# Altium schematic sheet Sheet1.SchDoc
size A4; SheetNumber: 1; SheetTotal: 1
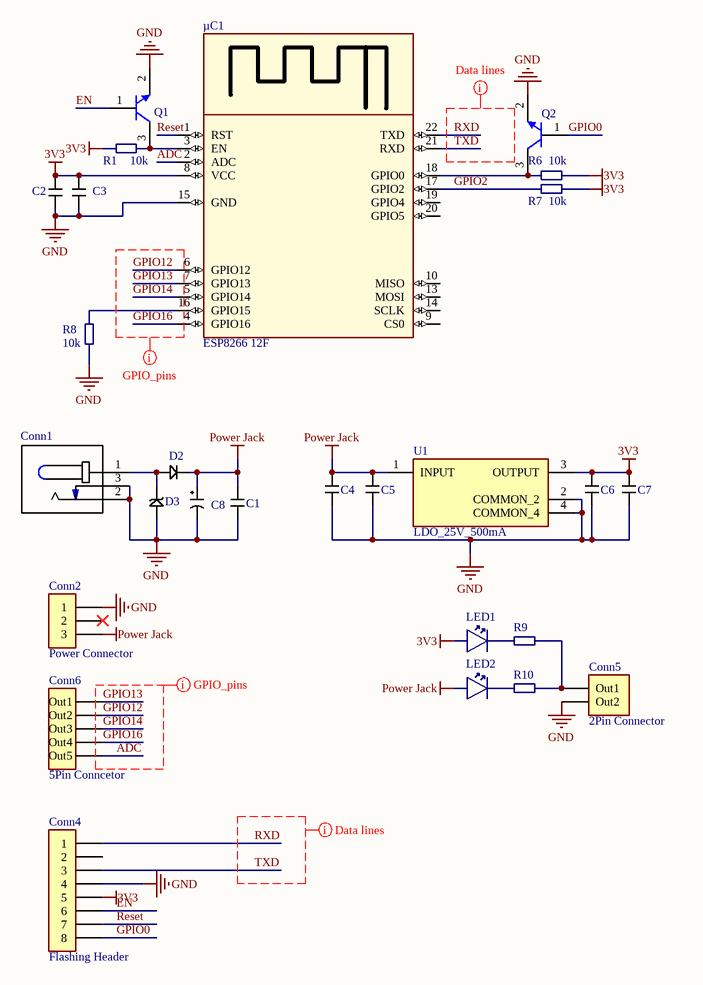
[diagram p0: Sheet1.SchDoc]

## Parts
C1  Cap 0603  [CAP 0603]  (value not drawn)
C2  Cap 0603  [CAP 0603]  (value not drawn)
C3  Cap 0603  [CAP 0603]  (value not drawn)
C4  Cap 0603  [CAP 0603]  (value not drawn)
C5  Cap 0603  [CAP 0603]  (value not drawn)
C6  Cap 0603  [CAP 0603]  (value not drawn)
C7  Cap 0603  [CAP 0603]  (value not drawn)
C8  ElcoCap  [SMD Elco]  (value not drawn)
Conn1  Power Jack SMD rechtwinklig  [Power Jack]  (value not drawn)
Conn2  Power Connector  [3Pin CONNECTOR]
Conn4  Flashing Header  [Flashing header 2*5]
Conn5  2Pin Connector  [2PIN Connector]
Conn6  5Pin Conncetor  [5PIN CONNECTOR]
D2  Schottky Diode  [SS34-HF]  (value not drawn)
D3  TVS Diode  [SMAJ24A]  (value not drawn)
LED1  LED SMD  [LED 0603]  (value not drawn)
LED2  LED SMD  [LED 0603]  (value not drawn)
Q1  BC818-40LT1G  [ONSC-SOT-23-3-318-08_V]  (value not drawn)
Q2  BC818-40LT1G  [ONSC-SOT-23-3-318-08_V]  (value not drawn)
R1  10k  [RES 0603]
R6  10k  [RES 0603]
R7  10k  [RES 0603]
R8  10k  [RES 0603]
R9  Res 0603  [RES 0603]  (value not drawn)
R10  Res 0603  [RES 0603]  (value not drawn)
U1  LDO_25V_500mA  [UA78M33CDCYRG3]
µC1  ESP8266 12F  [ESP8266 12F]

## Nets
3V3: C2.2 C3.2 C6.2 C7.2 Conn4.5 LED1.1 R1.2 R6.2 R7.2 U1.3(OUTPUT) µC1.8(VCC)
GND: C1.1 C2.1 C3.1 C4.1 C5.1 C6.1 C7.1 C8.2(N) Conn1.2 Conn1.3 Conn2.3(1) Conn4.4 Conn5.2(Out2) D3.1 Q1.2(E) Q2.2(E) R8.1 U1.2(COMMON_2) U1.4(COMMON_4) µC1.15(GND)
Power Jack: C1.2 C4.2 C5.2 C8.1(P) Conn2.1(3) D2.2 LED2.1 U1.1(INPUT)
ADC: Conn6.5(Out5) µC1.2(ADC)
EN: Conn4.6 Q1.1(B)
GPIO0: Conn4.8 Q2.1(B)
GPIO2: R7.1 µC1.17(GPIO2)
GPIO12: Conn6.2(Out2) µC1.6(GPIO12)
GPIO13: Conn6.1(Out1) µC1.7(GPIO13)
GPIO14: Conn6.3(Out3) µC1.5(GPIO14)
GPIO16: Conn6.4(Out4) µC1.4(GPIO16)
Reset: Conn4.7 µC1.1(RST)
RXD: Conn4.1 µC1.22(TXD)
TXD: Conn4.3 µC1.21(RXD)
NetConn1_1: Conn1.1 D2.1 D3.2
NetConn5_1: Conn5.1(Out1) R9.2 R10.2
NetLED1_2: LED1.2 R9.1
NetLED2_2: LED2.2 R10.1
NetQ1_3: Q1.3(C) R1.1 µC1.3(EN)
NetQ2_3: Q2.3(C) R6.1 µC1.18(GPIO0)
NetR8_2: R8.2 µC1.16(GPIO15)

Not connected (* = marked no-connect by the designer): Conn2 2*; Conn4 2; µC1 9(CS0) 10(MISO) 13(MOSI) 14(SCLK) 19(GPIO4) 20(GPIO5)

## Layout directives
mark named GPIO_pins: ADC, GPIO12, GPIO13, GPIO14, GPIO16
mark named Data lines: RXD, TXD
net class data: RXD, TXD

## Library data of the parts
Conn2 = 3Pin Connector
Q1 Q2 = CMP-1048-00772-1: General Purpose Transistor, NPN Silicon, 3-Pin SOT-23, Pb-Free, Tape and Reel; Manufacturer: On Semiconductor; fT Min (MHz): 100; IC Continuous (A): 0.5; ComponentLink1URL: http://www.onsemi.com/; ComponentLink2URL: http://www.onsemi.com/pub_link/Collateral/BC818-40LT-D.PDF; ComponentLink2Description: Datasheet; ComponentLink1Description: Manufacturer URL; ComponentLink3Description: Package Specification; Mounting Technology: Surface Mount; PackageVersion: Rev. AP, 11/2009; PartNumber: BC818-40LT1G; Packing: Tape and Reel; DatasheetVersion: Rev. 3; RoHS: TRUE; ComponentLink3URL: http://www.onsemi.cn/pub_link/Collateral/318-08.PDF; PackageDescription: 3-Pin Small Outline Transistor, Body 2.92 x 1.3 mm, Pitch 0.95 mm; Polarity: NPN; PackageReference: SOT-23-3-318-08
R1 R6-R8 = Res 0603